# Altium project Gestus.PrjPcb
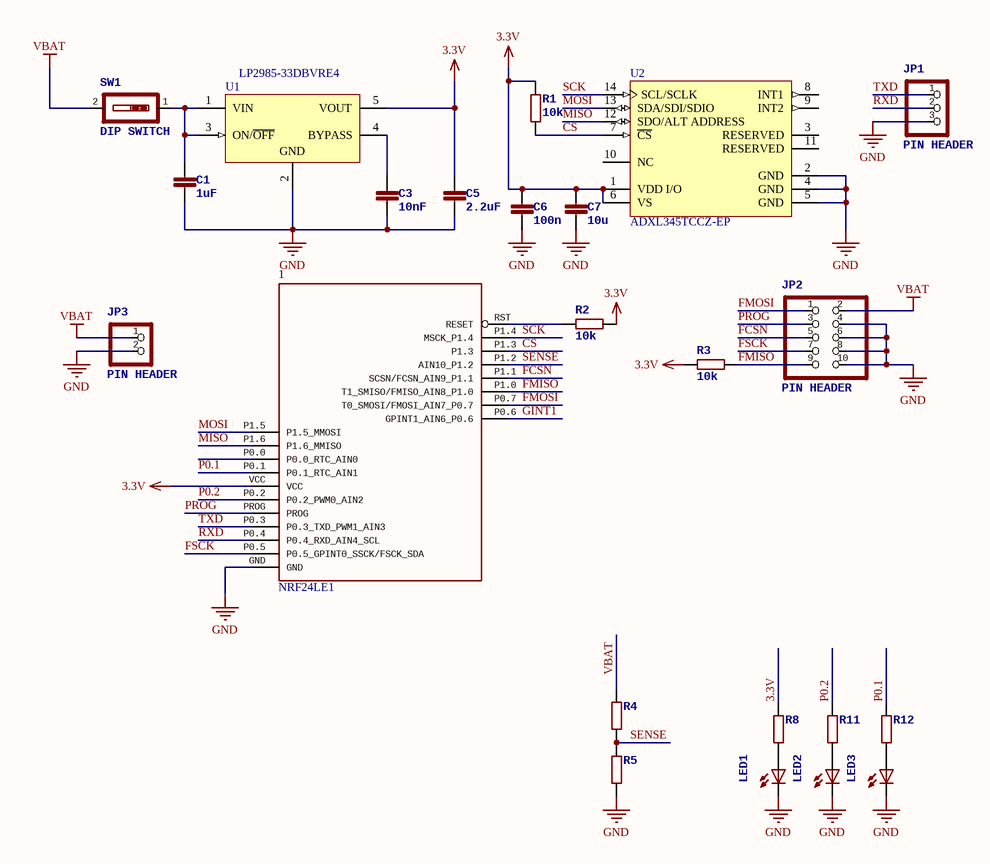
[diagram p0: ruka.SchDoc]
1 sheet, 23 parts. Net scope: global (net labels, ports and power ports of the same name join across sheets).
Board file: hand.PcbDoc

## Sheet ruka.SchDoc
size A4

### Parts
1  NRF24LE1  [SMDNRF]
C1  1uF  [C0805K]
C3  10nF  [C0805K]
C5  2.2uF  [C0805K]
C6  100n  [C0805K]
C7  10u  [C0805K]
JP1  PIN HEADER  [1X03/90]
JP2  PIN HEADER  [2X05/90]
JP3  PIN HEADER  [1X02/90]
LED1  LED   OSRAM: - CHIPLED LG R971, LG N971, LY N971, LG Q971, LY Q971, LO R971, LY R971 LH N974, LH R974 LS Q976, LO  [CHIP-LED0603]  (value not drawn)
LED2  LED   OSRAM: - CHIPLED LG R971, LG N971, LY N971, LG Q971, LY Q971, LO R971, LY R971 LH N974, LH R974 LS Q976, LO  [CHIP-LED0603]  (value not drawn)
LED3  LED   OSRAM: - CHIPLED LG R971, LG N971, LY N971, LG Q971, LY Q971, LO R971, LY R971 LH N974, LH R974 LS Q976, LO  [CHIP-LED0603]  (value not drawn)
R1  10k  [R0805]
R2  10k  [R0805]
R3  10k  [R0805]
R4  (no value)  [R0805]
R5  (no value)  [R0805]
R8  (no value)  [R0805]
R11  (no value)  [R0805]
R12  (no value)  [R0805]
SW1  DIP SWITCH  [EDG-01]
U1  LP2985-33DBVRE4  [TI-DBV5_V]
U2  ADXL345TCCZ-EP  [ADI-CC-14-1_V]

### Nets
3.3V: 1.VCC C5.1 C6.1 C7.1 R1.2 R2.1 R3.1 R8.2 U1.5(VOUT) U2.1(VDD_I/O) U2.6(VS)
GND: 1.GND C1.2 C3.2 C5.2 C6.2 C7.2 JP1.3 JP2.4 JP2.6 JP2.8 JP2.10 JP3.2 LED1.C LED2.C LED3.C R5.1 U1.2(GND) U2.2(GND) U2.4(GND) U2.5(GND)
VBAT: JP2.2 JP3.1 R4.2 SW1.2
~{CS}: 1.P1.3 R1.1 U2.7(~{CS})
FCSN: 1.P1.1(SCSN/FCSN_AIN9_P1.1) JP2.5
FMISO: 1.P1.0(T1_SMISO/FMISO_AIN8_P1.0) JP2.9 R3.2
FMOSI: 1.P0.7(T0_SMOSI/FMOSI_AIN7_P0.7) JP2.1
FSCK: 1.P0.5(P0.5_GPINT0_SSCK/FSCK_SDA) JP2.7
GINT1: 1.P0.6(GPINT1_AIN6_P0.6)
MISO: 1.P1.6(P1.6_MMISO) U2.12(SDO/ALT_ADDRESS)
MOSI: 1.P1.5(P1.5_MMOSI) U2.13(SDA/SDI/SDIO)
P0.1: 1.P0.1(P0.1_RTC_AIN1) R12.2
P0.2: 1.P0.2(P0.2_PWM0_AIN2) R11.2
PROG: 1.PROG JP2.3
RXD: 1.P0.4(P0.4_RXD_AIN4_SCL) JP1.2
SCK: 1.P1.4(MSCK_P1.4) U2.14(SCL/SCLK)
SENSE: 1.P1.2(AIN10_P1.2) R4.1 R5.2
TXD: 1.P0.3(P0.3_TXD_PWM1_AIN3) JP1.1
Net1_RST: 1.RST(RESET) R2.2
NetC1_1: C1.1 SW1.1 U1.1(VIN) U1.3(ON/~{OFF})
NetC3_1: C3.1 U1.4(BYPASS)
NetLED1_A: LED1.A R8.1
NetLED2_A: LED2.A R11.1
NetLED3_A: LED3.A R12.1

Not connected (* = marked no-connect by the designer): 1 P0.0(P0.0_RTC_AIN0); U2 3(RESERVED) 8(INT1) 9(INT2) 10(NC) 11(RESERVED)

### Library data of the parts
C1 C3 C5-C7 = C-EUC0805K
JP1 = PINHD-1X3/90
JP2 = PINHD-2X5/90
JP3 = PINHD-1X2/90
LED1-LED3 = LEDCHIP-LED0603
R1-R5 R8 R11 R12 = R-EU_R0805
SW1 = SW_DIP-1
U1 = CMP-0758-00029-1: Single Output Low Noise LDO, 150 mA, Fixed 3.3 V Output, 1.5% Tolerance, 2.2 to 16 V Input, Low IQ, 5-Pin SOT-23 (DBV), -40 to 125 degC, Green (RoHS & no Sb/Br), Tape and Reel; Manufacturer: Texas Instruments; Iout (Max) (A): 0.15; Output Options: Fixed Output; Fixed Output Options (V): 3.3; Vdo (Typ) (mV): 280; Accuracy (%): 1.5; Iq (Typ) (mA): 0.85; DatasheetVersion: SLVS522N; ComponentLink3URL: http://www.ti.com/litv/pdf/mpds018j; PackageDescription: 5-Pin Plastic Small Outline, Body 2.9 x 1.6 mm, Pitch 0.95 mm; PackageReference: DBV5; ComponentLink2URL: http://www.ti.com/lit/ds/symlink/lp2985-50.pdf; ComponentLink3Description: Package Specification; ComponentLink1URL: http://www.ti.com/; Operating Temperature Range (degC): -40 to 125; Mounting Technology: Surface Mount; PackageVersion: 4073253-4/L; ComponentLink2Description: Datasheet; ComponentLink1Description: Manufacturer URL; Packing: Tape and Reel; PartNumber: LP2985-33DBVRE4; Vin (V): 2.2 to 16; RoHS: TRUE
U2 = CMP-0885-00034-1: 3-Axis, +/-2 g / +/-4 g / +/-8 g / +/-16 g Digital Accelerometer with Digital Output, 1.6 KHz BW, Industrial, 14-pin LGA, Tray; Manufacturer: Analog Devices; Supply Current: 140 uA; -3dB Bandwidth: 1.6 KHz; Voltage Supply (V): 2.0 to 3.6; # of Axes: 3; Sensitivity: 256/128/64/32 LSB/g; DatasheetVersion: Rev. A; ComponentLink3URL: http://www.analog.com/static/imported-files/data_sheets/ADXL343.pdf; PackageDescription: 14-Pin Land Grid Array, 3 x 5 mm Body, 0.8 mm Pitch; PartNumber: ADXL345TCCZ-EP; PackageVersion: 03-16-2010-A, 03/2010; Packing: Tray; ComponentLink1Description: Manufacturer URL; ComponentLink2Description: Datasheet; ComponentLink2URL: http://www.analog.com/static/imported-files/data_sheets/ADXL345-EP.pdf; PackageReference: CC-14-1; ComponentLink4Description: Product URL; ComponentLink4URL: http://www.analog.com/en/mems-sensors/mems-inertial-sensors/adxl345/products/product.html; Mounting Technology: Surface Mount; Output Type: Digital; ComponentLink1URL: http://www.analog.com/en/index.html; ComponentLink3Description: Package Specification